# EasyEDA Pro project Commuta_PCBv2.epro

# Schematic Schematic1
Board Name: Board1; Create Date: 2026-05-23; Page Name: P1; Project Name: 便携式空气质量检测设备; Schematic Name: Schematic1; Update Date: 2026-05-23; BladeWidth: 10; Company: 嘉立创EDA; Page Size: A4; RegionStart: 1; ShowBorder: 1; TitleBlock: 0; TitleBlockPosition: 3; Version: V1.0; XRegionCount: 6; YRegionCount: 4
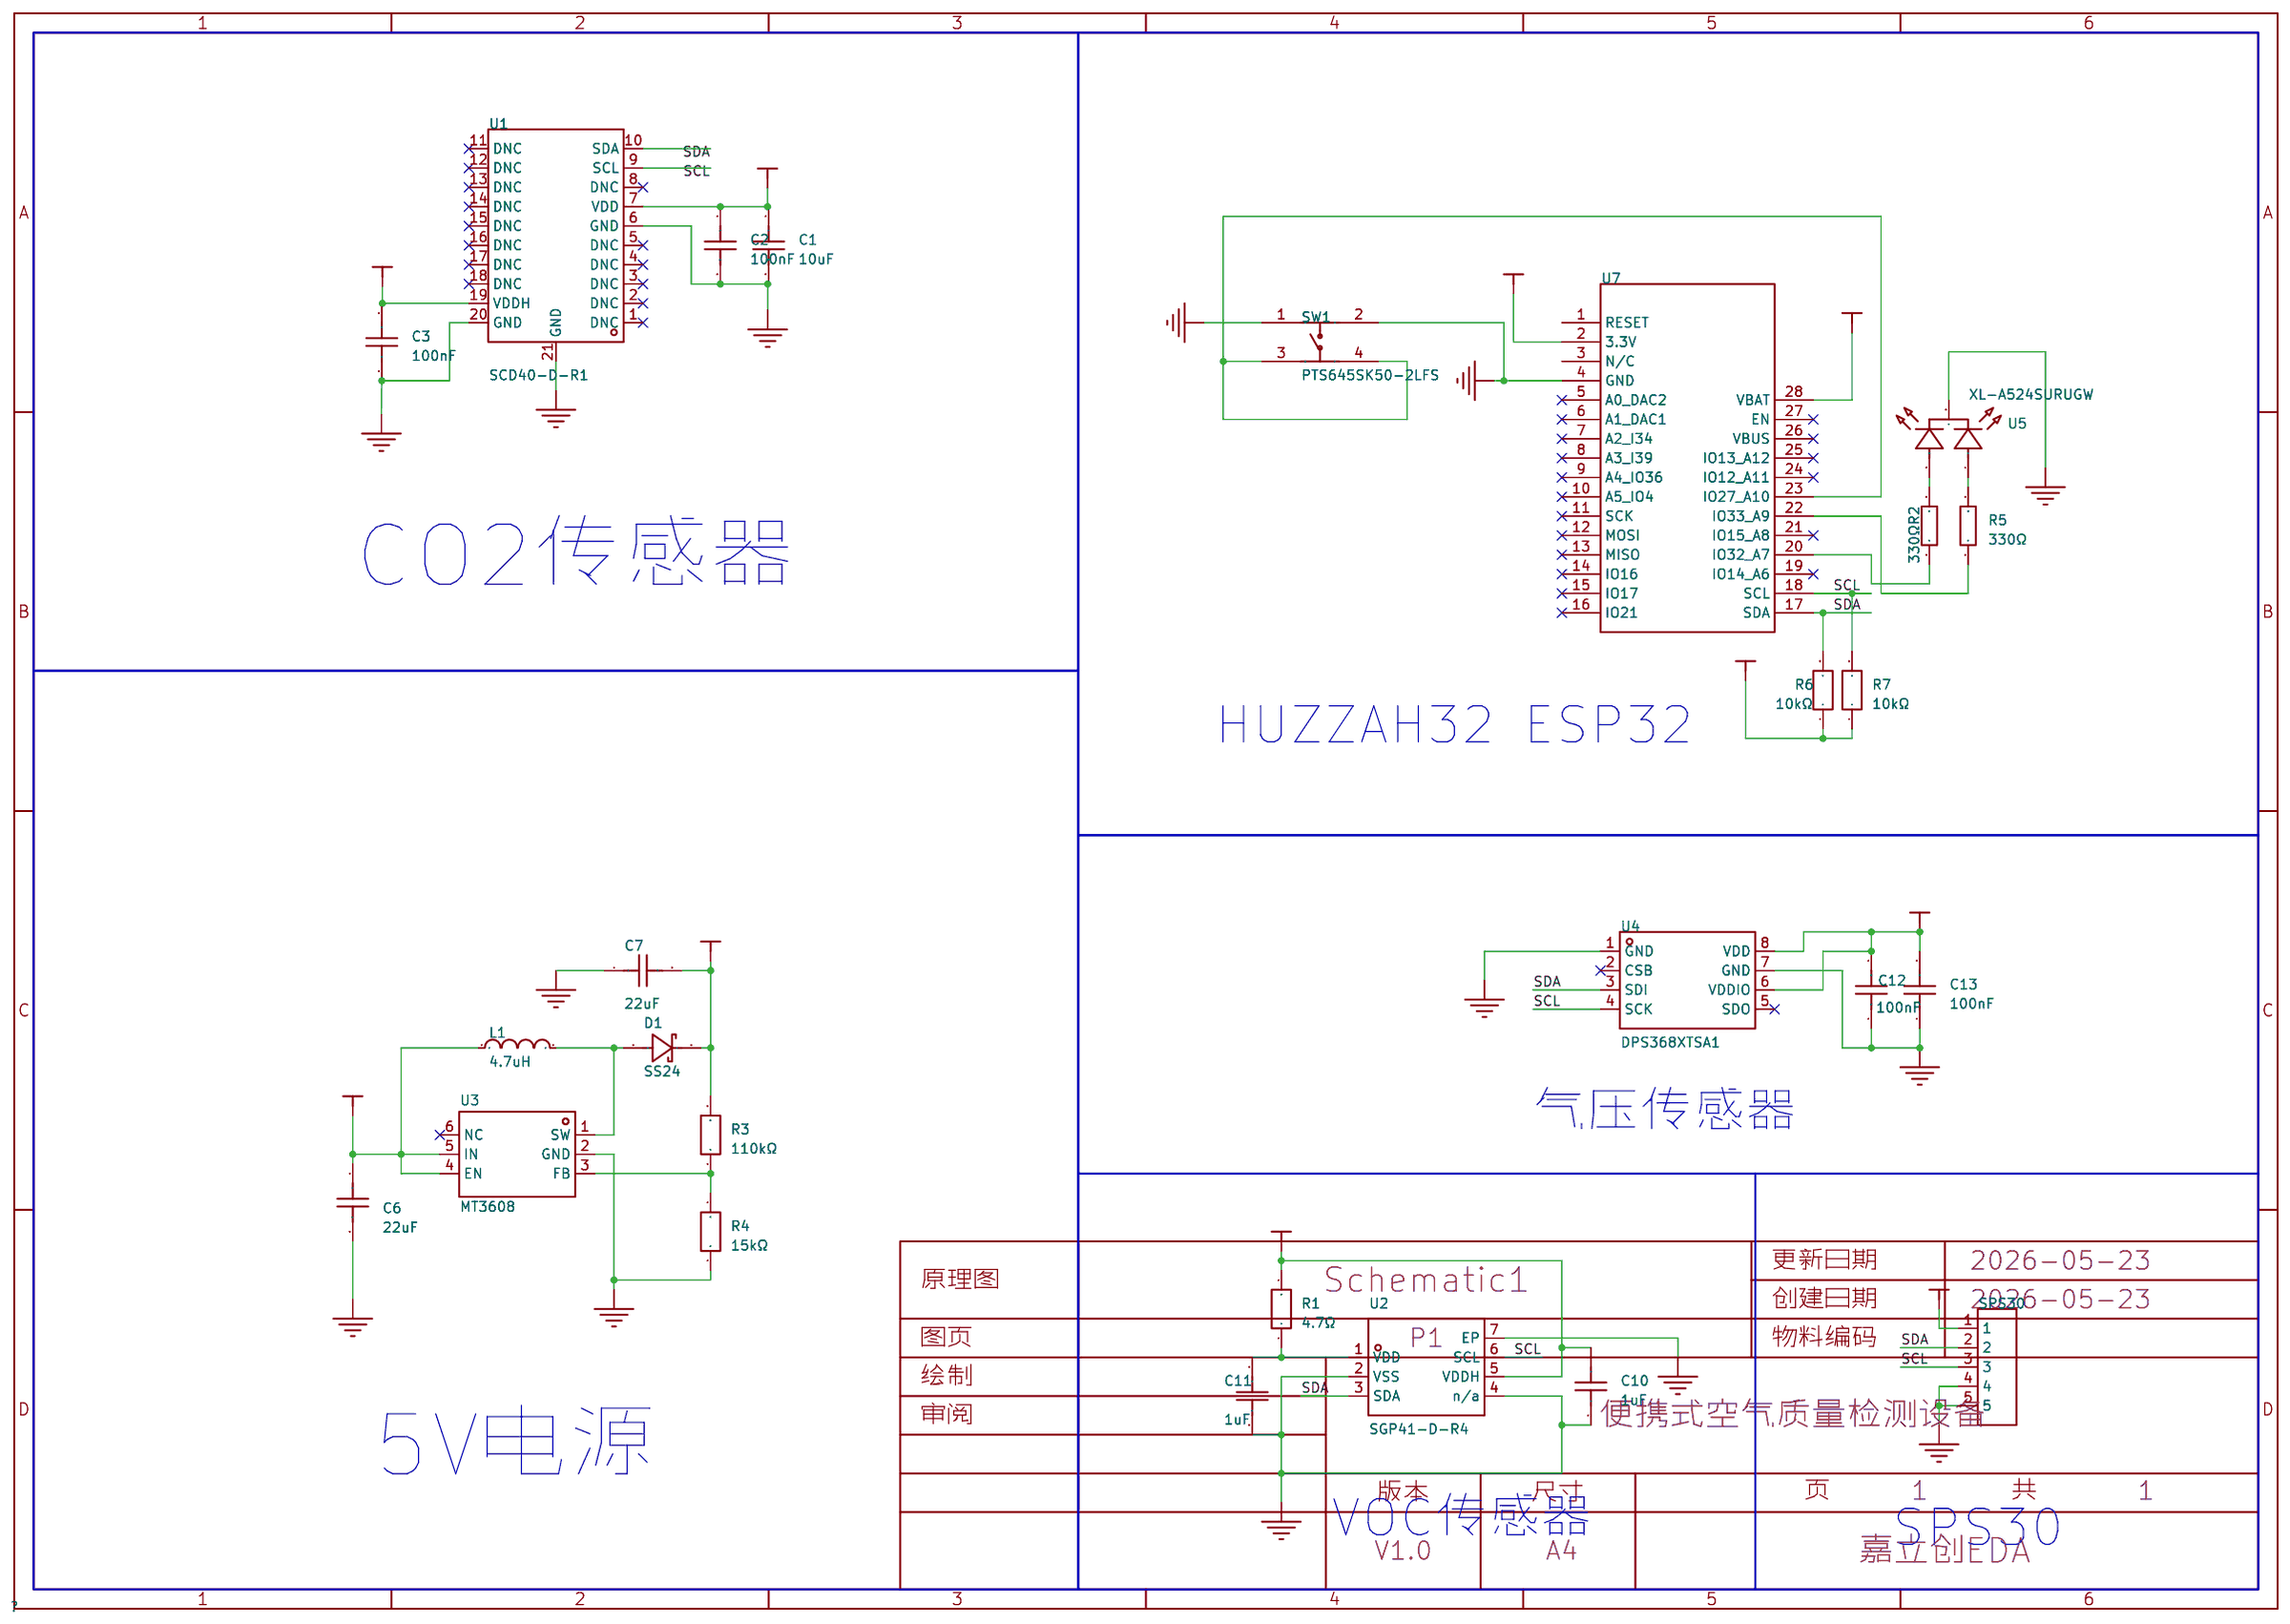
[diagram p0: schematic sheet]

## Parts
C1  10uF  [C0805]
C2  100nF  [C0603]
C3  100nF  [C0603]
C6  22uF  [C0603]
C7  22uF  [C0603]
C10  1uF  [C0603]
C11  1uF  [C0603]
C12  100nF  [C0603]
C13  100nF  [C0603]
D1  SS24  [SMA_L4.3-W2.6-LS5.0-FD]
L1  4.7uH  [IND-SMD_L5.0-W5.0_FNR50XXS]
R1  4.7Ω  [R0603]
R2  330Ω  [R0603]
R3  110kΩ  [R0603]
R4  15kΩ  [R0603]
R5  330Ω  [R0603]
R6  10kΩ  [R0603]
R7  10kΩ  [R0603]
SPS30  PZ254V-11-05P  [HDR-TH_5P-P2.54-V-M]
SW1  PTS645SK50-2LFS  [KEY-TH_4P-L6.0-W6.0-P4.50-LS6.50]
U1  SCD40-D-R1  [LGA-20_L10.1-W10.1-P1.25-TL]
U2  SGP41-D-R4  [DFN-6_L2.4-W2.4-P0.80-TL-EP]
U3  MT3608  [SOT-23-6_L2.9-W1.6-P0.95-LS2.8-BL]
U4  DPS368XTSA1  [LGA-8_L2.5-W2.0-P0.65-TR_DPS368]
U5  XL-A524SURUGW  [LED-TH_3P-BD5.8-P2.54-1]
U7  -  [HUZZAH32 ESP32]

## Library data of the parts
C1 = CGA0805X5R106K250MT: 容值:10uF;精度:±10%;额定电压:25V;温度系数:X5R;; LCSC Part Name: 10uF ±10% 25V; Supplier Part: C6119887; Manufacturer: HRE(芯声); Supplier Footprint: 0805; JLCPCB Part Class: Extended Part; Datasheet: https://item.szlcsc.com/datasheet/CGA0805X5R106K250MT/7062593.html; Supplier: LCSC; Tolerance: ±10%; Voltage Rating: 25V; Temperature Coefficient: X5R
C2 C3 C12 C13 = CGA0603X7R104K500JT: 容值:100nF;精度:±10%;额定电压:50V;温度系数:X7R;; LCSC Part Name: 100nF ±10% 50V; Supplier Part: C6119867; Manufacturer: HRE(芯声); Supplier Footprint: 0603; JLCPCB Part Class: Extended Part; Datasheet: https://item.szlcsc.com/datasheet/CGA0603X7R104K500JT/7062573.html; Supplier: LCSC; Tolerance: ±10%; Voltage Rating: 50V; Temperature Coefficient: X7R
C6 C7 = CGA0603X5R226M160JT: 容值:22uF;精度:±20%;额定电压:16V;温度系数:X5R;; LCSC Part Name: 22uF ±20% 16V; Supplier Part: C6119868; Manufacturer: HRE(芯声); Supplier Footprint: 0603; JLCPCB Part Class: Extended Part; Datasheet: https://item.szlcsc.com/datasheet/CGA0603X5R226M160JT/7062574.html; Supplier: LCSC; Tolerance: ±20%; Voltage Rating: 16V; Temperature Coefficient: X5R
C10 C11 = CGA0603X5R105K500JT: 容值:1uF;精度:±10%;额定电压:50V;温度系数:X5R;; LCSC Part Name: 1uF ±10% 50V; Supplier Part: C6119852; Manufacturer: HRE(芯声); Supplier Footprint: 0603; JLCPCB Part Class: Extended Part; Datasheet: https://item.szlcsc.com/datasheet/CGA0603X5R105K500JT/7062558.html; Supplier: LCSC; Tolerance: ±10%; Voltage Rating: 50V; Temperature Coefficient: X5R
D1 = SS24_C7420362: 二极管配置:独立式;正向压降(Vf):550mV@2A;直流反向耐压(Vr):40V;整流电流:2A;; LCSC Part Name: 电压:40V 电流:2A; Supplier Part: C7420362; Manufacturer: R+O(宏嘉诚); Supplier Footprint: SMA(DO-214AC); JLCPCB Part Class: Extended Part; Datasheet: https://item.szlcsc.com/datasheet/SS24/8397184.html; Supplier: LCSC; Diode Configuration: 独立式; Voltage - Forward(Vf@If): 550mV@2A; Voltage - DC Reverse(Vr): 40V; Current - Rectified: 2A; Reverse Leakage Current (Ir): 200uA@40V; Operating Junction Temperature Range: -55℃~+150℃; Non-Repetitive Peak Forward Surge Current: 50A
L1 = FNR5040S4R7MT: 电感值:4.7uH;精度:±20%;额定电流:3.3A;饱和电流(Isat):3.8A;类型:磁胶屏蔽电感;; LCSC Part Name: 4.7uH ±20% 3.8A; Supplier Part: C167963; Manufacturer: cjiang(长江微电); Supplier Footprint: SMD,5x5mm; JLCPCB Part Class: Extended Part; Datasheet: https://item.szlcsc.com/datasheet/FNR5040S4R7MT/179346.html; Supplier: LCSC; Tolerance: ±20%; Current Rating: 3.3A; Current - Saturation(Isat): 3.8A; DC Resistance(DCR): 39mΩ; Type: 磁胶屏蔽电感
R1 = FRC0603F1001TS: 电阻类型:厚膜电阻;阻值:1kΩ;精度:±1%;功率:100mW;工作电压:75V;温度系数:±100ppm/℃;; LCSC Part Name: 1kΩ ±1% 100mW 厚膜电阻; Supplier Part: C2907002; Manufacturer: FOJAN(富捷); Supplier Footprint: 0603; JLCPCB Part Class: Extended Part; Supplier: LCSC; Type: 厚膜电阻; Tolerance: ±1%; Power(Watts): 100mW; Voltage-Supply(Max): 75V; Temperature Coefficient: ±100ppm/℃; Operating Temperature: -55℃~+155℃
R2 R5 = 0603WAF3303T5E: 电阻类型:厚膜电阻;阻值:330kΩ;精度:±1%;功率:100mW;最大工作电压:75V;温度系数:±100ppm/℃;; LCSC Part Name: 330kΩ ±1% 100mW 厚膜电阻; Supplier Part: C23137; Manufacturer: UNI-ROYAL(厚声); Supplier Footprint: 0603; JLCPCB Part Class: Basic Part; Datasheet: https://atta.szlcsc.com/upload/public/pdf/source/20200306/C422600_1E6D84923E4A46A82E41ADD87F860B5C.pdf; Supplier: LCSC; Type: 厚膜电阻; Tolerance: ±1%; Power(Watts): 100mW; Overload Voltage (Max): 75V; Temperature Coefficient: ±100ppm/℃; Operating Temperature Range: -55℃~+155℃
R3 = FRC0603F1103TS: 电阻类型:厚膜电阻;阻值:110kΩ;精度:±1%;功率:100mW;工作电压:75V;温度系数:±100ppm/℃;; LCSC Part Name: 110kΩ ±1% 100mW 厚膜电阻; Supplier Part: C2906984; Manufacturer: FOJAN(富捷); Supplier Footprint: 0603; JLCPCB Part Class: Extended Part; Supplier: LCSC; Type: 厚膜电阻; Tolerance: ±1%; Power(Watts): 100mW; Voltage-Supply(Max): 75V; Temperature Coefficient: ±100ppm/℃; Operating Temperature: -55℃~+155℃
R4 = FRC0603F1502TS: 电阻类型:厚膜电阻;阻值:15kΩ;精度:±1%;功率:100mW;工作电压:75V;温度系数:±100ppm/℃;; LCSC Part Name: 15kΩ ±1% 100mW 厚膜电阻; Supplier Part: C2906995; Manufacturer: FOJAN(富捷); Supplier Footprint: 0603; JLCPCB Part Class: Extended Part; Supplier: LCSC; Type: 厚膜电阻; Tolerance: ±1%; Power(Watts): 100mW; Voltage-Supply(Max): 75V; Temperature Coefficient: ±100ppm/℃; Operating Temperature: -55℃~+155℃
R6 R7 = FRC0603J103 TS: 电阻类型:厚膜电阻;阻值:10kΩ;精度:±5%;功率:100mW;工作电压:75V;温度系数:±100ppm/℃;; LCSC Part Name: 10kΩ ±5% 100mW 厚膜电阻; Supplier Part: C2930027; Manufacturer: FOJAN(富捷); Supplier Footprint: 0603; JLCPCB Part Class: Extended Part; Datasheet: https://item.szlcsc.com/datasheet/FRC0603J103%2520TS/3266960.html; Supplier: LCSC; Type: 厚膜电阻; Tolerance: ±5%; Power(Watts): 100mW; Voltage-Supply(Max): 75V; Temperature Coefficient: ±100ppm/℃; Operating Temperature: -55℃~+155℃
SPS30 = PZ254V-11-05P: 插针结构:1x5P;间距:2.54mm;行距:-;圆针/方针:方针;安装方式:直插;排数:单排;总PIN位数:5P;额定电流:3A;额定电压:250V;配合针长度:6mm;塑高:2.5mm;端接针长度:3mm;触头材质:黄铜;触头镀层:-;工作温度:-40℃~+105℃;颜色:黑色;; LCSC Part Name: 1x5P 间距:2.54mm 方针 直插; Supplier Part: C492404; Manufacturer: XFCN(兴飞); Supplier Footprint: 插件,P=2.54mm; JLCPCB Part Class: Extended Part; Datasheet: https://item.szlcsc.com/datasheet/PZ254V-11-05P/502960.html; Supplier: LCSC; Pin Structure: 1x5P; Pitch: 2.54mm; Circluar Pins/Square Pins: 方针; Mounting Type: 直插; Number of Rows: 单排; Number of Pins: 5P; Current Rating: 3A; Voltage Rating (Max): 250V; Length of Mating Pin: 6mm; Insulation Height: 2.5mm; Length of End Connection Pin: 3mm; Contact Material: 黄铜; Operating Temperature: -40℃~+105℃; Color: 黑色
SW1 = PTS645SK50-2LFS: 电路结构:单刀单掷;按钮形状:圆形按钮;作用力:2.6N;安装方式:直插;开关长度:6mm;开关宽度:6mm;带支架:不带支架;触点电流:50mA;额定电压:12V;带灯:无;工作寿命:10万次;; LCSC Part Name: 6mm*6mm 12V 50mA; Supplier Part: C2689653; Manufacturer: C&K; Supplier Footprint: 插件-4P,6x6mm; JLCPCB Part Class: Extended Part; Datasheet: https://item.szlcsc.com/datasheet/PTS645SK50-2LFS/2796858.html; Supplier: LCSC; Circuit: 单刀单掷; Actuator Style: 圆形按钮; Operating Force: 2.6N; Mounting Type: 直插; Length: 6mm; Width: 6mm; with Bracket: 不带支架; Contact Current: 50mA; Voltage Rating: 12V; With Lamp: 无; Termination Style: PC引脚; Life: 10万次
U1 = SCD40-D-R1: 气体类型:空气质量;测量范围:0ppm~40000ppm;接口类型:I2C;精度:±5%;; LCSC Part Name: 3.000.496 3.000.496 紧凑且具成本效益的光声式 NDIR CO₂ 二氧化碳传感器; Supplier Part: C3037696; Manufacturer: Sensirion(瑞士盛思锐); Supplier Footprint: SMD; JLCPCB Part Class: Extended Part; Datasheet: https://item.szlcsc.com/datasheet/SCD40-D-R1/3589639.html; Supplier: LCSC; Type: 空气质量; Measurement Range: 0ppm~40000ppm; Voltage - Supply: 2.4V~5.5V; Interface: I2C; Tolerance: ±5%; Operating Temperature: -10℃~+60℃; Length: 10.1mm; Width: 10.1mm; Height: 6.5mm; Current - Supply: 0.36mA; Features: 复位功能
U2 = SGP41-D-R4: VOC（挥发性有机化合物）和Nox （氮氧化合物） 传感器（用于智能调节空气处理设备）; LCSC Part Name: 3.000.060 3.000.060 适用于室内空气质量应用的 VOC 与 NOx 传感器; Supplier Part: C3659325; Manufacturer: Sensirion(瑞士盛思锐); Supplier Footprint: DFN-6(2.4x2.4); JLCPCB Part Class: Extended Part; Datasheet: https://item.szlcsc.com/datasheet/SGP41-D-R4/4227122.html; Supplier: LCSC
U3 = MT3608: 功能类型:升压型;输出类型:可调;工作电压:2V~24V;输出电压:-;输出电流:2A;; LCSC Part Name: 老版本 高效1.2MHz 2A升压转换器; Supplier Part: C84817; Manufacturer: 西安航天民芯; Supplier Footprint: SOT-23-6; JLCPCB Part Class: Extended Part; Datasheet: https://item.szlcsc.com/datasheet/MT3608/85988.html; Supplier: LCSC; Function: 升压型; Output Type: 可调; Voltage - Supply: 2V~24V; Output Current: 2A; Frequency - Switching: 1.2MHz; Operating Temperature: -40℃~+85℃; Synchronous Rectifier: 否; Number of Outputs: 1; Topology: 升压式; Quiescent Current: 100uA；1.6mA; Switch tube (built-in/external): 内置
U4 = DPS368XTSA1: 压力范围:30Kpa~1.2bar;接口类型:I2C；SPI;; LCSC Part Name: 数字式气压传感器; Supplier Part: C3232508; Manufacturer: Infineon(英飞凌); Supplier Footprint: VLGA-8(2x2.5); JLCPCB Part Class: Extended Part; Datasheet: https://item.szlcsc.com/datasheet/DPS368XTSA1/3795529.html; Supplier: LCSC; Pressure range: 30Kpa~1.2bar; Voltage - Supply: 1.7V~3.6V; Standby Current: 500nA; Interface: I2C；SPI; Module: 否; Absolute Accuracy: 100pa; Relative Accuracy: 6pa; Features: 待机模式；集成ADC与数字接口；片内温度补偿；片内校准与非易失存储；片内温度输出; Temperature Coefficient of Offset(TCO): 0.5pa/K; Response time: 27.6ms; Operating Temperature: -40℃~+85℃
U5 = XL-A524SURUGW: 灯头类型:5mm圆形灯头;发光颜色:红色,翠绿色;正向压降(Vf):2.3V；3.4V;功率:50mW；70mW;正向电流:20mA;波长:520nm~530nm；635nm~640nm;二极管配置:共阴极;透镜颜色:-;色温:-;发光强度:800mcd；4cd;发光角度:30°;载带方式:-;工作温度:-20℃~+85℃;; LCSC Part Name: F5红翠绿雾状共阴; Supplier Part: C2895567; Manufacturer: XINGLIGHT(成兴光); Supplier Footprint: 插件,D=5mm; JLCPCB Part Class: Extended Part; Datasheet: https://item.szlcsc.com/datasheet/XL-A524SURUGW/3136232.html; Supplier: LCSC; Lamp Holder Type: 5mm圆形灯头; Illumination Color: 红色,翠绿色; Voltage - Forward(Vf): 2.3V；3.4V; Power(Watts): 50mW；70mW; Forward Current: 20mA; Wavelength - Dominant: 520nm~530nm；635nm~640nm; Peak Wavelength: 520nm；640nm; Diode Configuration: 共阴极; Luminous Intensity: 800mcd；4cd; Viewing Angle: 30°; Operating Temperature: -20℃~+85℃
U7 = HUZZAH32 ESP32

## Nets
+3.3V: C1.1 C2.1 C3.1 C10.2 C12.2 C13.2 R1.2 R6.1 R7.1 U1.7(VDD) U1.19(VDDH) U2.5(VDDH) U4.6(VDDIO) U4.8(VDD) U7.2(3.3V)
+5V: C7.2 D1.2(K) R3.2 SPS30.1
GND: C1.2 C2.2 C3.2 C6.2 C7.1 C10.1 C11.2 C12.1 C13.1 R4.1 SPS30.4 SPS30.5 SW1.1 SW1.2 U1.6(GND) U1.20(GND) U1.21(GND) U2.2(VSS) U2.4(n/a) U2.7(EP) U3.2(GND) U4.1(GND) U4.7(GND) U5.2(K) U7.4(GND)
VBAT: C6.1 L1.2 U3.4(EN) U3.5(IN) U7.28(VBAT)
SCL: R7.2 SPS30.3 U1.9(SCL) U2.6(SCL) U4.4(SCK) U7.18(SCL)
SDA: R6.2 SPS30.2 U1.10(SDA) U2.3(SDA) U4.3(SDI) U7.17(SDA)
$1N18: R3.1 R4.2 U3.3(FB)
$1N23: D1.1(A) L1.1 U3.1(SW)
$1N46: C11.1 R1.1 U2.1(VDD)
$1N54: R5.2 U5.1(A)
$1N55: R2.2 U5.3(A)
$1N59: R5.1 U7.22(IO33_A9)
$1N60: R2.1 U7.20(IO32_A7)
$1N68: SW1.3 SW1.4 U7.23(IO27_A10)

Not connected (* = marked no-connect by the designer): U1 1(DNC)* 2(DNC)* 3(DNC)* 4(DNC)* 5(DNC)* 8(DNC)* 11(DNC)* 12(DNC)* 13(DNC)* 14(DNC)* 15(DNC)* 16(DNC)* 17(DNC)* 18(DNC)*; U3 6(NC)*; U4 2(CSB)* 5(SDO)*; U7 1(RESET) 3(N/C) 5(A0_DAC2)* 6(A1_DAC1)* 7(A2_I34)* 8(A3_I39)* 9(A4_IO36)* 10(A5_IO4)* 11(SCK)* 12(MOSI)* 13(MISO)* 14(IO16)* 15(IO17)* 16(IO21)* 19(IO14_A6)* 21(IO15_A8)* 24(IO12_A11)* 25(IO13_A12)* 26(VBUS)* 27(EN)*

## Notes on the sheet
- CO2传感器
- HUZZAH32 ESP32
- 气压传感器
- 5V电源
- VOC传感器
- SPS30
